# EAGLE design Atmega162_expansion (EAGLE 4.16)
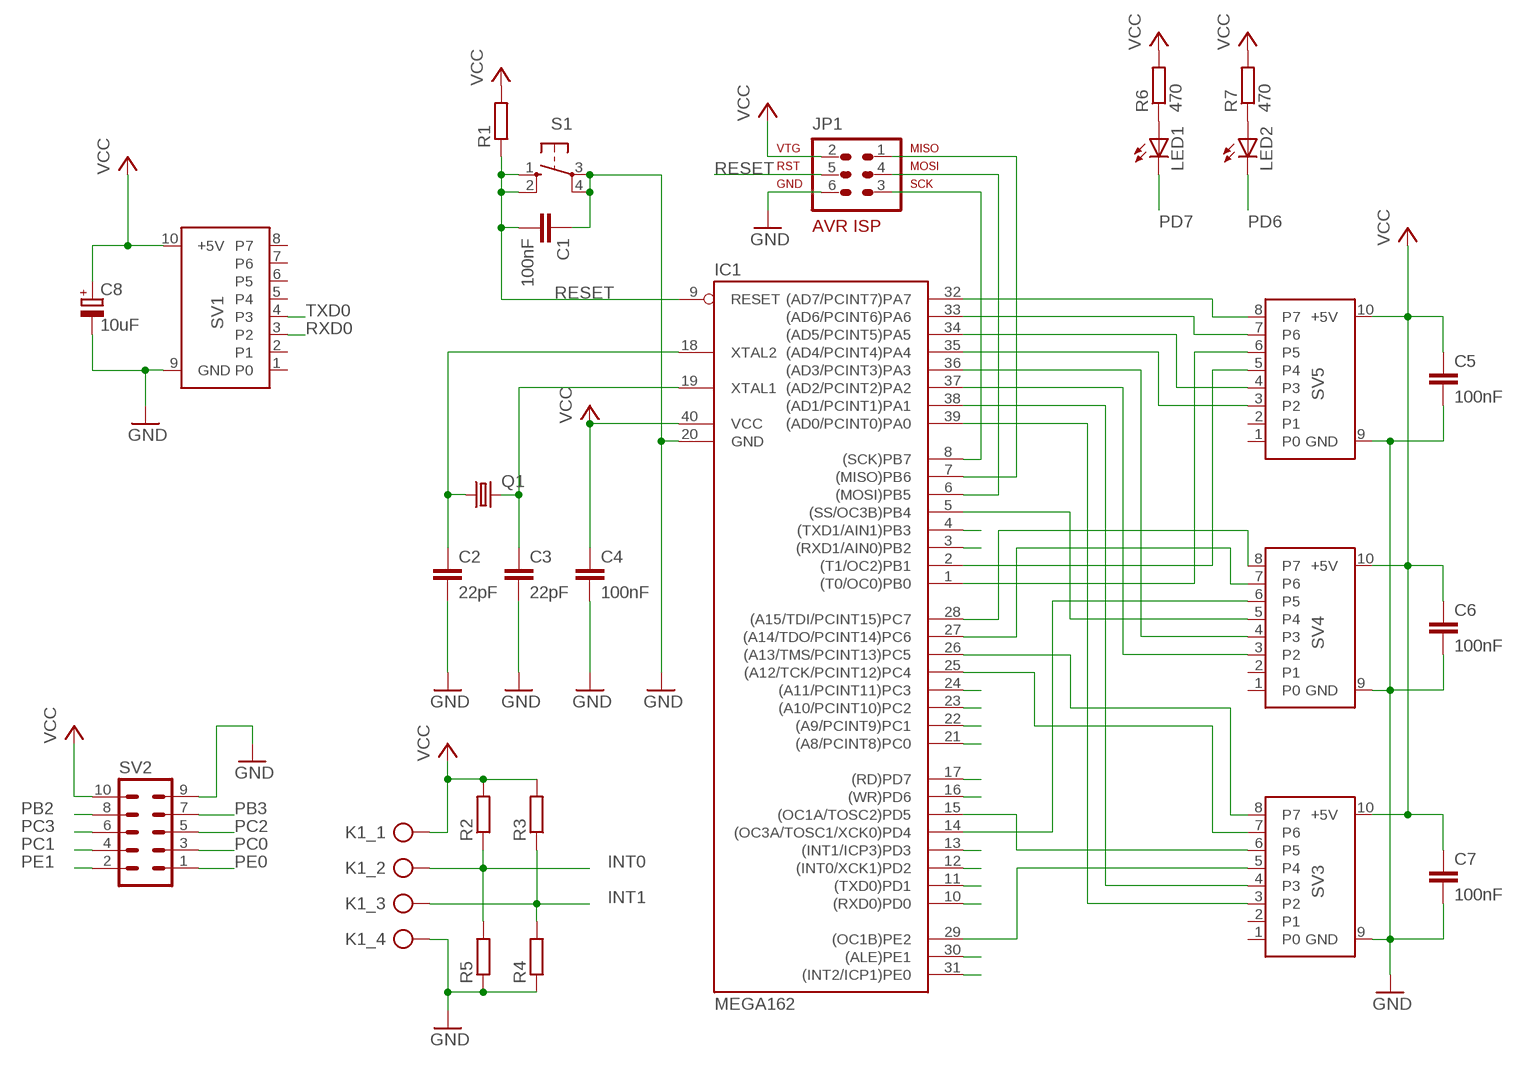
[diagram p0: schematic, sheet 1]

## Parts
C1  100nF  C-EU050-024X044  [C050-024X044]
C2  22pF  C-EU025-024X044  [C025-024X044]
C3  22pF  C-EU025-024X044  [C025-024X044]
C4  100nF  C-EU050-024X044  [C050-024X044]
C5  100nF  C-EU050-024X044  [C050-024X044]
C6  100nF  C-EU050-024X044  [C050-024X044]
C7  100nF  C-EU050-024X044  [C050-024X044]
C8  10uF  CPOL-EUE2.5-6  [E2,5-6]
IC1  MEGA162  [DIL40]
JP1  AVR-ISP-6RM2,54  [AVR-ISP-6]
K1  AST021-04  [AST021-04]
LED1  LED3MM  [LED3MM]
LED2  LED3MM  [LED3MM]
Q1  CRYTALHC49U-V  [HC49U-V]
R1  R-EU_0204/2V  [0204V]
R2  R-EU_0204/2V  [0204V]
R3  R-EU_0204/2V  [0204V]
R4  R-EU_0204/2V  [0204V]
R5  R-EU_0204/2V  [0204V]
R6  470  R-EU_0204/2V  [0204V]
R7  470  R-EU_0204/2V  [0204V]
S1  10-XX  [B3F-10XX]
SV1  PORT_WANNSTECKER  [ML10]
SV2  MA05-2  [MA05-2]
SV3  PORT_WANNSTECKER  [ML10]
SV4  PORT_WANNSTECKER  [ML10]
SV5  PORT_WANNSTECKER  [ML10]

## Nets
GND: C1.1 C2.2 C3.2 C4.2 C5.2 C6.2 C7.2 C8.- IC1.20(GND) JP1.6 K1.4 R4.1 R5.1 S1.3(P) S1.4(P1) SV1.9(GND) SV2.9 SV3.9(GND) SV4.9(GND) SV5.9(GND)
INT0: IC1.12((INT0/XCK1)PD2) K1.2 R2.1 R5.2
INT1: IC1.13((INT1/ICP3)PD3) K1.3 R3.1 R4.2
MISO: IC1.7((MISO)PB6) JP1.1
MOSI: IC1.6((MOSI)PB5) JP1.4
N$1: IC1.28((A15/TDI/PCINT15)PC7) SV4.8(P7)
N$2: IC1.15((OC1A/TOSC2)PD5) SV3.6(P5)
N$3: C2.1 IC1.18(XTAL2) Q1.1
N$4: C3.1 IC1.19(XTAL1) Q1.2
N$5: IC1.29((OC1B)PE2) SV3.5(P4)
N$6: IC1.14((OC3A/TOSC1/XCK0)PD4) SV4.6(P5)
N$7: IC1.5((SS/OC3B)PB4) SV4.5(P4)
N$8: IC1.1((T0/OC0)PB0) SV5.6(P5)
N$9: IC1.2((T1/OC2)PB1) SV5.5(P4)
N$10: IC1.27((A14/TDO/PCINT14)PC6) SV4.7(P6)
N$11: IC1.26((A13/TMS/PCINT13)PC5) SV3.8(P7)
N$12: IC1.25((A12/TCK/PCINT12)PC4) SV3.7(P6)
N$13: LED1.A R6.1
N$14: LED2.A R7.1
N$15: IC1.34((AD5/PCINT5)PA5) SV5.4(P3)
N$16: IC1.35((AD4/PCINT4)PA4) SV5.3(P2)
N$17: IC1.36((AD3/PCINT3)PA3) SV4.4(P3)
N$18: IC1.37((AD2/PCINT2)PA2) SV4.3(P2)
N$19: IC1.38((AD1/PCINT1)PA1) SV3.4(P3)
N$20: IC1.39((AD0/PCINT0)PA0) SV3.3(P2)
N$21: IC1.32((AD7/PCINT7)PA7) SV5.8(P7)
N$22: IC1.33((AD6/PCINT6)PA6) SV5.7(P6)
PB2: IC1.3((RXD1/AIN0)PB2) SV2.8
PB3: IC1.4((TXD1/AIN1)PB3) SV2.7
PC0: IC1.21((A8/PCINT8)PC0) SV2.3
PC1: IC1.22((A9/PCINT9)PC1) SV2.4
PC2: IC1.23((A10/PCINT10)PC2) SV2.5
PC3: IC1.24((A11/PCINT11)PC3) SV2.6
PD6: IC1.16((WR)PD6) LED2.K(C)
PD7: IC1.17((RD)PD7) LED1.K(C)
PE0: IC1.31((INT2/ICP1)PE0) SV2.1
PE1: IC1.30((ALE)PE1) SV2.2
RESET: C1.2 IC1.9(RESET) JP1.5 R1.1 S1.1(S) S1.2(S1)
RXD0: IC1.10((RXD0)PD0) SV1.3(P2)
SCK: IC1.8((SCK)PB7) JP1.3
TXD0: IC1.11((TXD0)PD1) SV1.4(P3)
VCC: C4.1 C5.1 C6.1 C7.1 C8.+ IC1.40(VCC) JP1.2 K1.1 R1.2 R2.2 R3.2 R6.2 R7.2 SV1.10(+5V) SV2.10 SV3.10(+5V) SV4.10(+5V) SV5.10(+5V)
Unconnected: SV1.1(P0) SV1.2(P1) SV1.5(P4) SV1.6(P5) SV1.7(P6) SV1.8(P7) SV3.1(P0) SV3.2(P1) SV4.1(P0) SV4.2(P1) SV5.1(P0) SV5.2(P1)

## Library data of the parts
C1-C7 = rcl:C-EU: CAPACITOR, European symbol
C8 = rcl:CPOL-EU: POLARIZED CAPACITOR, European symbol
IC1 = atmega162:MEGA162: MICROCONTROLLER 16 Kbytes FLASH 512 bytes EEPROM 1 Kbytes SRAM dual UART hardware multiplier Source: avr.lbr
JP1 = 01-Steckverbinder:AVR-ISP-6: AVR ISP-6 Serial Programming Header
K1 = 01-Klemmen:AST021-04
LED1 LED2 = led:LED: LED OSRAM: - CHIPLED LG R971, LG N971, LY N971, LG Q971, LY Q971, LO R971, LY R971 LH N974, LH R974 LS Q976, LO Q976, LY Q976 LO Q996 - Hyper CHIPLED LW Q18S LB Q993, LB Q99A, LB R99A - SideLED LS A670, LO A670, LY A670, LG A670, LP A670 LB A673, LV A673, LT A673, LW A673 LH A674 LY A675 LS A676, LA A676, LO A676, LY A676, LW A676 LS A679, LY A679, LG A679 - Hyper Micro SIDELED® LS Y876, LA Y876, LO Y876, LY Y876 LT Y87S - SmartLED LW L88C, LW L88S LB L89C, LB L89S, LG L890 LS L89K, LO L89K, LY L89K LS L896, LA L896, LO L896, LY L896 - TOPLED LS T670, LO T670, LY T670, LG T670, LP T670 LSG T670, LSP T670, LSY T670, LOP T670, LYG T670 LG T671, LOG T671, LSG T671 LB T673, LV T673, LT T673, LW T673 LH T674 LS T676, LA T676, LO T676, LY T676, LB T676, LH T676, LSB T676, LW T676 LB T67C, LV T67C, LT T67C, LS T67K, LO T67K, LY T67K, LW E67C LS E67B, LA E67B, LO E67B, LY E67B, LB E67C, LV E67C, LT E67C LW T67C LS T679, LY T679, LG T679 LS T770, LO T770, LY T770, LG T770, LP T770 LB T773, LV T773, LT T773, LW T773 LH T774 LS E675, LA E675, LY E675, LS T675 LS T776, LA T776, LO T776, LY T776, LB T776 LHGB T686 LT T68C, LB T68C - Hyper Mini TOPLED® LB M676 - Mini TOPLED Santana® LG M470 LS M47K, LO M47K, LY M47K Source: http://www.osram.convergy.de/
Q1 = crystal:CRYTAL: CRYSTAL
R1-R7 = rcl:R-EU_: RESISTOR, European symbol
S1 = switch-omron:10-XX: OMRON SWITCH
SV1 SV3-SV5 = 01-Steckverbinder:PORT_WANNSTECKER
SV2 = con-lstb:MA05-2: PIN HEADER

## Board
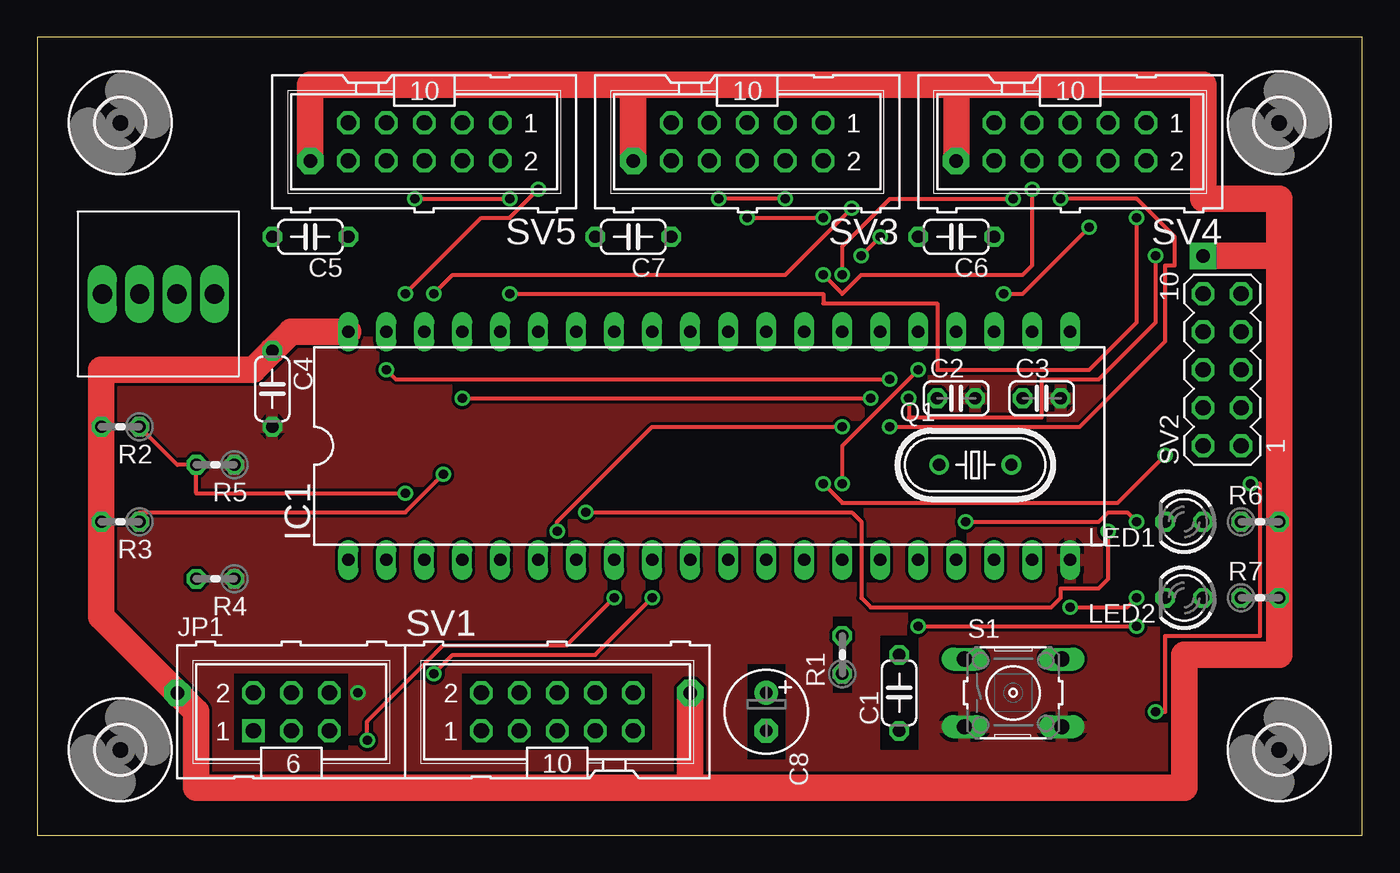
[diagram p1: board, top side]
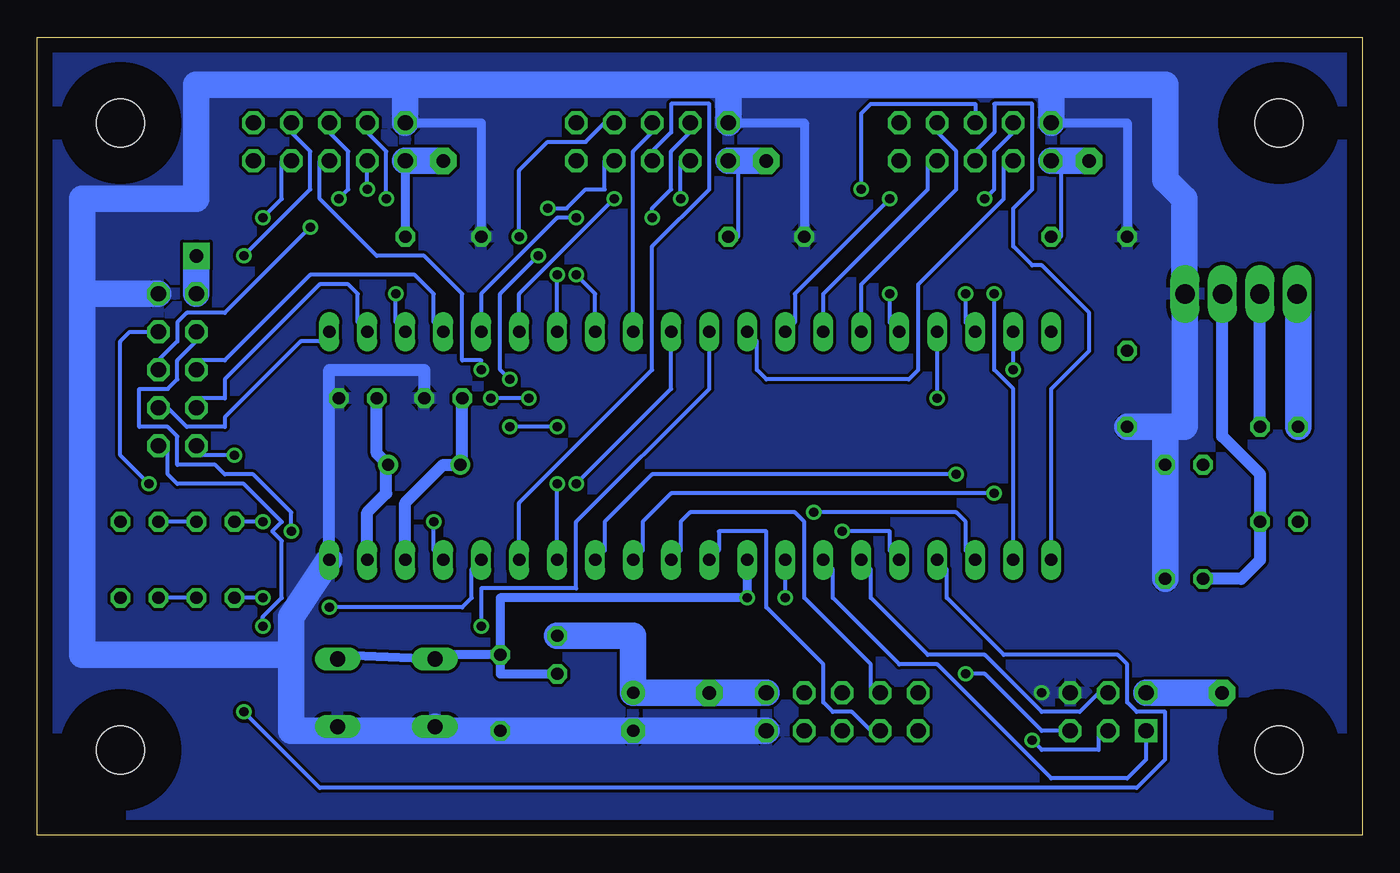
[diagram p2: board, bottom side, seen from below]

Size 88.57 x 53.33 mm. Coordinates in mm from the lower left corner, seen from the top.
Outline: 0,0 88.57,0 88.57,53.33 0,53.33 0,0
Copper layers (1*16): Top 0.035mm / dielectric 1.5mm / Bottom 0.035mm
Design rules "default": minimum track width 10mil, minimum drill 24mil, track to track 8mil, track to pad 8mil, pad to pad 8mil, via to via 8mil, smd to smd 8mil, copper to edge 40mil, drill to drill 8mil, minimum pad ring 10mil, minimum via ring 8mil, stop-mask expansion 4mil, vias tented up to drill 0mil, thermal gap 10mil
tRestrict: area 20.2,32.4 to 21.4,34.9; area 22.7,32.4 to 24,34.9; area 25.2,32.4 to 26.5,34.9; area 27.8,32.4 to 29,34.9; area 30.3,32.4 to 31.6,34.9; area 32.9,32.4 to 34.1,34.9; area 35.4,32.4 to 36.7,34.9; area 37.9,32.4 to 39.2,34.9; area 40.5,32.4 to 41.7,34.9; area 43,32.4 to 44.3,34.9; area 45.6,32.4 to 46.8,34.9; area 48.1,32.4 to 49.4,34.9; 46 more areas

### Footprints (pad centres in the part's own frame; a part is rotated, then mirrored left to right if it is on the bottom)
C050-024X044 = drill 0.813 octagon: 1 -2.54,0; 2 2.54,0
C025-024X044 = drill 0.813 octagon: 1 -1.27,0; 2 1.27,0
E2,5-6 = drill 0.813 pad 1.6 round: + -1.27,0 | drill 0.813 pad 1.6 octagon: - 1.27,0
DIL40 = drill 0.813 long: 1 -24.13,-7.62; 2 -21.59,-7.62; 3 -19.05,-7.62; 4 -16.51,-7.62; 5 -13.97,-7.62; 6 -11.43,-7.62; 7 -8.89,-7.62; 8 -6.35,-7.62; 9 -3.81,-7.62; 10 -1.27,-7.62; 11 1.27,-7.62; 12 3.81,-7.62; 13 6.35,-7.62; 14 8.89,-7.62; 15 11.43,-7.62; 16 13.97,-7.62; 17 16.51,-7.62; 18 19.05,-7.62; 19 21.59,-7.62; 20 24.13,-7.62; 21 24.13,7.62; 22 21.59,7.62; 23 19.05,7.62; 24 16.51,7.62; 25 13.97,7.62; 26 11.43,7.62; 27 8.89,7.62; 28 6.35,7.62; 29 3.81,7.62; 30 1.27,7.62; 31 -1.27,7.62; 32 -3.81,7.62; 33 -6.35,7.62; 34 -8.89,7.62; 35 -11.43,7.62; 36 -13.97,7.62; 37 -16.51,7.62; 38 -19.05,7.62; 39 -21.59,7.62; 40 -24.13,7.62
AVR-ISP-6 = drill 1.016 square: 1 -2.54,-1.27 | drill 1.016 octagon: 2 -2.54,1.27; 3 0,-1.27; 4 0,1.27; 5 2.54,-1.27; 6 2.54,1.27
AST021-04 = drill 1.3 long: 1 -3.75,0; 2 -1.25,0; 3 1.25,0; 4 3.75,0
LED3MM = drill 0.813 octagon: A -1.27,0; K 1.27,0
HC49U-V = drill 0.813 round: 1 -2.413,0; 2 2.413,0
0204V = drill 0.813 octagon: 1 -1.27,0; 2 1.27,0
B3F-10XX = drill 1.016 long: 1 -3.251,2.261; 2 3.251,2.261; 3 -3.251,-2.261; 4 3.251,-2.261
ML10 = drill 1.016 octagon: 1 -5.08,-1.27; 2 -5.08,1.27; 3 -2.54,-1.27; 4 -2.54,1.27; 5 0,-1.27; 6 0,1.27; 7 2.54,-1.27; 8 2.54,1.27; 9 5.08,-1.27; 10 5.08,1.27
MA05-2 = drill 1.016 octagon: 1 -5.08,-1.27; 2 -5.08,1.27; 3 -2.54,-1.27; 4 -2.54,1.27; 5 0,-1.27; 6 0,1.27; 7 2.54,-1.27; 8 2.54,1.27; 9 5.08,-1.27; 10 5.08,1.27
3,2 = hole 3.2: 0,0

### Placement (x,y rotation side)
C1  57.62,9.52 90 top
C2  61.43,29.2 0 top
C3  67.14,29.2 0 top
C4  15.71,29.84 270 top
C5  18.25,40 180 top
C6  61.43,40 180 top
C7  39.84,40 180 top
C8  48.73,8.25 270 top
IC1  44.92,26.03 0 top
JP1  16.98,8.25 0 top
K1  8.09,36.19 0 top
LED1  76.67,20.95 180 top
LED2  76.67,15.87 180 top
Q1  62.7,24.76 0 top
R1  53.81,12.06 90 top
R2  5.55,27.3 180 top
R3  5.55,20.95 180 top
R4  11.9,17.14 180 top
R5  11.9,24.76 180 top
R6  81.75,20.95 0 top
R7  81.75,15.87 0 top
S1  65.24,9.52 0 top
SV1  34.76,8.25 0 top
SV2  79.21,31.11 90 top
SV3  47.46,46.35 180 top
SV4  69.05,46.35 180 top
SV5  25.87,46.35 180 top
U$1  [3,2]  5.55,47.62 0 top
U$2  [3,2]  5.55,5.71 0 top
U$3  [3,2]  83.02,47.62 0 top
U$4  [3,2]  83.02,5.71 0 top

### Tracks (layer width: path | path; a pad name or v marks a point on that pad's centre or on a via)
GND  (via drill 0.61)
  Bottom 0.254: 69.05,6.98 S1.4
  Bottom 0.61: C7.2 37.3,47.62 SV3.9 | C5.2 15.71,47.62 SV5.9 | C6.2 58.89,47.62 SV4.9
  Bottom 0.813: 69.05,29.2 C3.2 | IC1.20 69.05,29.2 | C2.2 62.7,31.11 69.05,31.11 69.05,29.2
  Bottom 1.778: SV1.9 C8.- C1.1 61.43,6.98 | 61.43,6.98 69.05,6.98 71.59,6.98 71.59,12.06 | 71.59,12.06 71.59,14.6 IC1.20 | 61.43,6.98 S1.3 | 85.56,36.19 85.56,42.54 77.94,42.54 77.94,50.16 63.97,50.16 | 85.56,36.19 85.56,12.06 71.59,12.06 | 42.38,50.16 63.97,50.16 | 20.79,50.16 42.38,50.16 | 20.79,50.16 13.17,50.16 13.17,43.81 11.9,42.54 11.9,36.19 K1.4 11.84,27.36 11.9,27.3 13.17,27.3 | 63.97,50.16 SV4.9 | 42.38,50.16 SV3.9 | 20.79,50.16 SV5.9 | 13.17,27.3 C4.2 | 13.17,27.3 R5.1 R4.1 | 85.56,36.19 SV2.9
  other vias: 21.43,9.52
  pour Top: 0.47,52.7 0.47,0.63 88.1,0.63 88.1,52.7 1.11,52.7
  pour Bottom: 0.47,52.7 0.47,0.63 88.1,0.63 88.1,52.7
INT0  (via drill 0.61)
  Top 0.254: R2.1 9.36,24.76 R5.2 10.63,22.85 v24.6,22.85
  Bottom 0.254: v24.6,22.85 46.19,22.85 48.09,20.95 48.09,19.04 IC1.12
  Bottom 0.813: K1.2 6.84,27.32 R2.1
INT1  (via drill 0.61)
  Top 0.254: v27.14,24.12 24.6,21.58 6.82,21.58 R3.1
  Bottom 0.254: v27.14,24.12 47.46,24.12 50.64,20.95 50.64,19.04 IC1.13
  Bottom 0.813: R4.2 8.09,17.14 6.82,18.41 R3.1 6.82,24.12 9.36,26.66 9.36,36.19 K1.3
MISO
  Bottom 0.254: IC1.7 35.39,17.77 35.39,15.87 30.95,11.43 28.41,11.43 20.79,3.8 15.71,3.8 14.44,5.07 JP1.1
MOSI
  Bottom 0.254: IC1.6 32.86,17.77 32.86,15.87 29.04,12.06 25.23,12.06 21.43,8.25 18.89,8.25 17.61,9.52 JP1.4
N$1  (via drill 0.61)
  Top 0.254: v52.54,37.46 53.81,36.19 55.08,37.46 65.88,37.46 66.51,38.09 v66.51,43.17
  Bottom 0.254: v52.54,37.46 51.27,36.19 IC1.28 | v66.51,43.17 SV4.8
N$2
  Bottom 0.254: IC1.15 56.35,22.22 47.46,31.11 47.46,39.37 43.65,43.17 43.65,48.89 46.19,48.89 46.19,46.98 47.46,45.71 SV3.6
N$3
  Bottom 0.813: IC1.18 63.97,22.22 61.43,24.76 Q1.1 | Q1.1 60.16,24.76 | Q1.1 60.16,24.89 C2.1
N$4
  Bottom 0.813: IC1.19 66.51,21.58 65.24,22.85 65.24,24.76 Q1.2 65.88,25.52 C3.1
N$5
  Bottom 0.254: IC1.29 48.73,45.71 47.46,46.98 SV3.5
N$6  (via drill 0.61)
  Top 0.254: v53.81,23.49 53.81,26.03 v58.89,31.11
  Bottom 0.254: v58.89,31.11 58.89,31.74 60.16,31.74 60.16,36.19 62.7,38.73 65.88,38.73 69.69,42.54 69.69,45.08 SV4.6 | IC1.14 v53.81,23.49
N$7  (via drill 0.61)
  Top 0.254: v34.76,20.31 34.76,20.95 41.11,27.3 v53.81,27.3 | v56.98,27.3 69.69,27.3 75.4,33.02 75.4,38.09 76.03,38.09 76.03,40 73.49,42.54 v68.41,42.54
  Bottom 0.254: v34.76,20.31 31.58,20.31 31.58,19.04 IC1.5 | v53.81,27.3 v56.98,27.3 | v68.41,42.54 67.78,43.17 67.78,45.71 69.05,46.98 SV4.5
N$8
  Bottom 0.254: IC1.1 20.79,29.84 18.25,32.38 18.25,34.92 21.43,38.09 22.06,38.09 23.33,39.37 23.33,41.91 22.06,43.17 22.06,48.89 24.6,48.89 24.6,46.98 25.87,45.71 SV5.6
N$9  (via drill 0.61)
  Top 0.254: v24.6,36.19 29.68,41.27 31.58,41.27 v33.49,43.17
  Bottom 0.254: v24.6,36.19 24.6,31.11 23.33,29.84 IC1.2 | v33.49,43.17 33.49,48.25 32.86,48.89 25.87,48.89 SV5.5
N$10  (via drill 0.61)
  Top 0.254: v53.81,37.46 53.81,39.37 56.98,42.54 v65.24,42.54
  Bottom 0.254: v65.24,42.54 65.24,45.71 66.51,46.98 SV4.7 | IC1.27 v53.81,37.46
N$11  (via drill 0.61)
  Top 0.254: v50,42.54 v45.56,42.54
  Bottom 0.254: v50,42.54 56.35,36.19 IC1.26 | v45.56,42.54 45.56,45.08 SV3.8
N$12  (via drill 0.61)
  Top 0.254: v47.46,41.27 v52.54,41.27
  Bottom 0.254: v52.54,41.27 53.81,41.27 58.89,36.19 IC1.25 | v47.46,41.27 47.46,41.91 46.19,43.17 46.19,45.71 44.92,46.98 SV3.7
N$13
  Bottom 0.254: LED1.A R6.1
N$14
  Bottom 0.254: LED2.A R7.1
N$15
  Bottom 0.254: IC1.34 36.03,36.19 29.04,43.17 29.04,45.08 SV5.4
N$16
  Bottom 0.254: IC1.35 33.49,36.82 27.14,43.17 27.14,45.71 28.41,46.98 SV5.3
N$17  (via drill 0.61)
  Top 0.254: v31.58,36.19 52.54,36.19 52.54,35.55 60.16,35.55 60.16,31.11 70.32,31.11 73.49,34.28 v73.49,41.27
  Bottom 0.254: v31.58,36.19 31.58,34.28 IC1.36 | v73.49,41.27 72.22,42.54 72.22,45.08 SV4.4
N$18  (via drill 0.61)
  Top 0.254: v28.41,29.2 v55.72,29.2 | v58.25,29.2 58.25,27.93 67.14,27.93 67.14,30.47 70.95,30.47 74.77,34.28 v74.77,38.73
  Bottom 0.254: v55.72,29.2 v58.25,29.2 | v74.77,38.73 70.32,43.17 70.32,45.71 71.59,46.98 SV4.3 | v28.41,29.2 IC1.37
N$19  (via drill 0.61)
  Top 0.254: v26.5,36.19 27.77,37.46 50,37.46 v54.44,41.91
  Bottom 0.254: v26.5,36.19 26.5,34.28 IC1.38 | v54.44,41.91 53.17,41.91 51.91,43.17 50.64,43.17 50.64,45.08 SV3.4
N$20  (via drill 0.61)
  Top 0.254: v23.33,31.11 23.96,30.47 v56.98,30.47 | v55.08,38.73 v56.35,40
  Bottom 0.254: v56.98,30.47 57.62,31.11 57.62,36.19 v55.08,38.73 | v56.35,40 56.35,44.45 54.44,46.35 51.91,46.35 50.64,47.62 SV3.3 | v23.33,31.11 IC1.39
N$21
  Bottom 0.254: IC1.32 40.47,33.02 40.47,31.11 39.84,30.47 30.32,30.47 29.68,31.11 29.68,36.82 23.96,42.54 23.96,45.08 SV5.8
N$22  (via drill 0.61)
  Top 0.254: v25.23,42.54 v31.58,42.54
  Bottom 0.254: v31.58,42.54 37.94,36.19 37.94,34.28 IC1.33 | v25.23,42.54 24.6,43.17 24.6,45.71 23.33,46.98 SV5.7
PB2  (via drill 0.61)
  Top 0.254: v36.67,21.58 54.44,21.58 55.08,20.95 55.08,15.87 55.72,15.24 67.78,15.24 68.41,15.87 68.41,16.5 70.95,16.5 71.59,17.14 v71.59,20.31
  Bottom 0.254: v36.67,21.58 27.14,21.58 26.5,20.95 26.5,19.04 IC1.3 | v71.59,20.31 71.59,21.58 74.13,24.12 76.03,24.12 76.67,24.76 79.21,24.76 79.21,26.66 79.84,27.3 81.75,27.3 81.75,29.84 79.84,29.84 79.21,30.47 79.21,31.74 77.94,33.02 SV2.8
PB3  (via drill 0.61)
  Top 0.254: v74.77,8.25 75.4,8.25 75.4,13.33 81.75,13.33 81.75,23.49 v81.11,23.49
  Bottom 0.254: v74.77,8.25 69.69,3.17 15.07,3.17 13.17,5.07 13.17,8.25 15.07,8.25 15.71,8.88 15.71,11.43 16.34,12.06 23.96,12.06 27.77,15.87 27.77,17.77 IC1.4 | v81.11,23.49 83.02,25.39 83.02,33.02 82.38,33.65 SV2.7
PC0
  Bottom 0.254: IC1.21 69.69,33.02 70.95,33.02 76.03,27.93 76.03,27.3 78.58,27.3 79.84,28.57 SV2.3
PC1
  Bottom 0.254: IC1.22 67.14,34.28 67.14,36.19 67.78,36.82 69.69,36.82 76.03,30.47 76.03,29.2 77.94,29.2 SV2.4
PC2  (via drill 0.61)
  Top 0.254: v64.6,36.19 65.88,36.19 v70.32,40.63
  Bottom 0.254: v64.6,36.19 64.6,34.28 IC1.23 | v70.32,40.63 76.03,34.92 78.58,34.92 79.21,34.28 79.21,33.02 80.48,31.74 SV2.5
PC3
  Bottom 0.254: IC1.24 62.06,34.28 62.06,36.19 63.33,37.46 70.32,37.46 76.03,31.74 77.94,31.74 SV2.6
PD6  (via drill 0.61)
  Top 0.254: v69.05,15.24 72.86,15.24 v73.49,15.87
  Bottom 0.254: v69.05,15.24 60.16,15.24 59.53,15.87 59.53,17.77 IC1.16 | v73.49,15.87 LED2.K
PD7  (via drill 0.61)
  Top 0.254: v62.06,20.95 70.95,20.95 71.59,21.58 72.86,21.58 v73.49,20.95
  Bottom 0.254: v62.06,20.95 62.06,19.04 IC1.17 | v73.49,20.95 LED1.K
PE0  (via drill 0.61)
  Top 0.254: v58.89,13.96 v73.49,13.96
  Bottom 0.254: v58.89,13.96 58.89,16.5 52.54,16.5 52.54,20.95 43.65,29.84 IC1.31 | v73.49,13.96 73.49,14.6 72.22,15.87 72.22,19.68 72.86,20.31 72.22,20.95 74.77,23.49 79.21,23.49 79.84,24.12 79.84,26.03 SV2.1
PE1  (via drill 0.61)
  Top 0.254: v52.54,23.49 53.81,22.22 72.22,22.22 v75.4,25.39
  Bottom 0.254: v52.54,23.49 46.19,29.84 IC1.30 | v75.4,25.39 77.94,25.39 SV2.2
RESET  (via drill 0.61)
  Top 0.254: v26.5,10.79 27.77,12.06 37.3,12.06 v41.11,15.87
  Bottom 0.254: 69.05,12.06 S1.2 | 62.7,12.06 S1.1 | v26.5,10.79 25.23,10.79 21.43,6.98 JP1.5
  Bottom 0.61: C1.2 62.7,12.06 | S1.1 69.05,12.06 | R1.1 57.62,10.79 C1.2 | C1.2 57.62,15.87 v41.11,15.87 IC1.9
RXD0
  Bottom 0.254: IC1.10 43.02,19.04 43.02,20.31 39.84,20.31 39.84,15.24 36.03,11.43 36.03,8.88 35.39,8.25 34.12,8.25 32.86,6.98 SV1.3
SCK  (via drill 0.61)
  Top 0.254: v38.57,15.87 35.39,12.7 27.14,12.7 22.06,7.62 v22.06,6.35
  Bottom 0.254: v22.06,6.35 21.43,5.71 17.61,5.71 17.61,6.98 JP1.3 | v38.57,15.87 IC1.8
TXD0
  Bottom 0.254: IC1.11 45.56,19.04 45.56,20.95 44.92,21.58 37.94,21.58 37.3,20.95 37.3,15.87 32.86,11.43 32.86,9.52 SV1.4
VCC  (via drill 0.9 pad 1.78)
  Top 1.778: 43.65,3.17 76.67,3.17 76.67,12.06 83.02,12.06 R7.2 R6.2 83.02,38.73 | 83.02,38.73 83.02,42.54 77.94,42.54 77.94,50.16 61.43,50.16 | 61.43,50.16 v61.43,45.08 | 61.43,50.16 39.84,50.16 | 39.84,50.16 v39.84,45.08 | v18.25,45.08 18.25,50.16 39.84,50.16 | 43.65,3.17 10.63,3.17 10.63,8.25 v9.36,9.52 4.28,14.6 R3.2 R2.2 4.28,31.11 14.44,31.11 C4.1 16.98,33.65 IC1.40 | 83.02,38.73 v77.94,38.73 | 43.65,3.17 v43.65,9.52
  Bottom 0.254: C5.1 20.16,40 20.16,45.08 | C7.1 41.75,40 41.75,45.08
  Bottom 0.61: SV4.10 C6.1
  Bottom 1.778: R1.2 48.73,13.33 C8.+ v43.65,9.52 SV1.10 | v61.43,45.08 SV4.10 | v39.84,45.08 41.75,45.08 SV3.10 | v18.25,45.08 20.16,45.08 SV5.10 | v9.36,9.52 JP1.2 | K1.1 4.28,36.19 R2.2 | v77.94,38.73 SV2.10